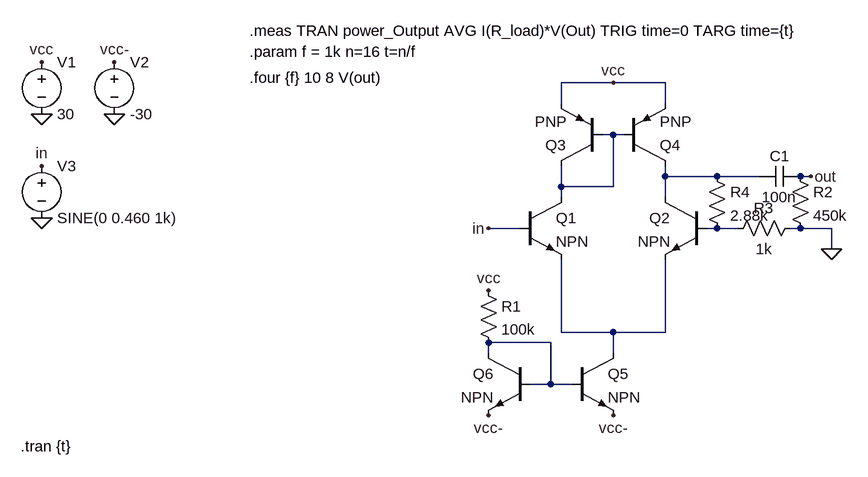
[diagram p0: schematic differential.asc]
differential.asc, the LTspice schematic file:
Version 4
SHEET 1 880 680
WIRE 240 -64 160 -64
WIRE 320 -64 240 -64
WIRE 160 -32 160 -64
WIRE 320 -32 320 -64
WIRE 240 16 224 16
WIRE 256 16 240 16
WIRE 320 80 320 64
WIRE 400 80 320 80
WIRE 464 80 400 80
WIRE 544 80 528 80
WIRE 160 96 160 64
WIRE 240 96 240 16
WIRE 240 96 160 96
WIRE 160 112 160 96
WIRE 320 112 320 80
WIRE 96 160 48 160
WIRE 400 160 384 160
WIRE 432 160 400 160
WIRE 528 160 512 160
WIRE 576 160 528 160
WIRE 576 192 576 160
WIRE 160 320 160 208
WIRE 240 320 160 320
WIRE 320 320 320 208
WIRE 320 320 240 320
WIRE 144 336 48 336
WIRE 48 352 48 336
WIRE 240 352 240 320
WIRE 144 400 144 336
WIRE 144 400 112 400
WIRE 176 400 144 400
FLAG 544 80 out
FLAG -640 -16 0
FLAG -528 -16 0
FLAG -640 -96 vcc
FLAG -528 -96 vcc-
FLAG 240 -64 vcc
FLAG 576 192 0
FLAG 48 160 in
FLAG -640 144 0
FLAG -640 64 in
FLAG 48 448 vcc-
FLAG 240 448 vcc-
FLAG 48 256 vcc
SYMBOL npn 96 112 R0
SYMATTR InstName Q1
SYMBOL npn 384 112 M0
SYMATTR InstName Q2
SYMBOL voltage -640 -112 R0
WINDOW 123 0 0 Left 0
WINDOW 39 0 0 Left 0
SYMATTR InstName V1
SYMATTR Value 30
SYMBOL voltage -528 -112 R0
WINDOW 123 0 0 Left 0
WINDOW 39 0 0 Left 0
SYMATTR InstName V2
SYMATTR Value -30
SYMBOL res 528 144 R90
WINDOW 0 0 56 VBottom 2
WINDOW 3 32 56 VTop 2
SYMATTR InstName R3
SYMATTR Value 1k
SYMBOL res 384 64 R0
SYMATTR InstName R4
SYMATTR Value 2.88k
SYMBOL voltage -640 48 R0
WINDOW 123 0 0 Left 0
WINDOW 39 0 0 Left 0
SYMATTR InstName V3
SYMATTR Value SINE(0 0.460 1k)
SYMBOL pnp 224 64 R180
SYMATTR InstName Q3
SYMBOL pnp 256 64 M180
SYMATTR InstName Q4
SYMBOL npn 176 352 R0
SYMATTR InstName Q5
SYMBOL npn 112 352 M0
SYMATTR InstName Q6
SYMBOL res 32 240 R0
SYMATTR InstName R1
SYMATTR Value 100k
SYMBOL res 512 64 R0
SYMATTR InstName R2
SYMATTR Value 450k
SYMBOL cap 528 64 R90
WINDOW 0 0 32 VBottom 2
WINDOW 3 32 32 VTop 2
SYMATTR InstName C1
SYMATTR Value 100n
TEXT -672 496 Left 2 !.tran {t}
TEXT -320 -112 Left 2 !.param f = 1k n=16 t=n/f
TEXT -320 -72 Left 2 !.four {f} 10 8 V(out)
TEXT -320 -144 Left 2 !.meas TRAN power_Output AVG I(R_load)*V(Out) TRIG time=0 TARG time={t}

The netlist it stands for:
* differential.asc
Q1 N001 in N004 0 NPN
Q2 N002 N003 N004 0 NPN
V1 vcc 0 30
V2 vcc- 0 -30
R3 0 N003 1k
R4 N002 N003 2.88k
V3 in 0 SINE(0 0.460 1k)
Q3 N001 N001 vcc 0 PNP
Q4 N002 N001 vcc 0 PNP
Q5 N004 N005 vcc- 0 NPN
Q6 N005 N005 vcc- 0 NPN
R1 vcc N005 100k
R2 out 0 450k
C1 out N002 100n
.model NPN NPN
.model PNP PNP
.lib standard.bjt
.tran {t}
.param f = 1k n=16 t=n/f
.four {f} 10 8 V(out)
.meas TRAN power_Output AVG I(R_load)*V(Out) TRIG time=0 TARG time={t}
.backanno
.end